# Altium schematic sheet RP2350_CNC_board.SchDoc: RP2040 CNC
size C; Author: AM; CompanyName: Expatria Technologies; DrawnBy: A.Marles; Engineer: AM; Organization: Expatria Technolgoies; Address1: Schematic; DocumentNumber: 2; SheetNumber: 2; SheetTotal: 14
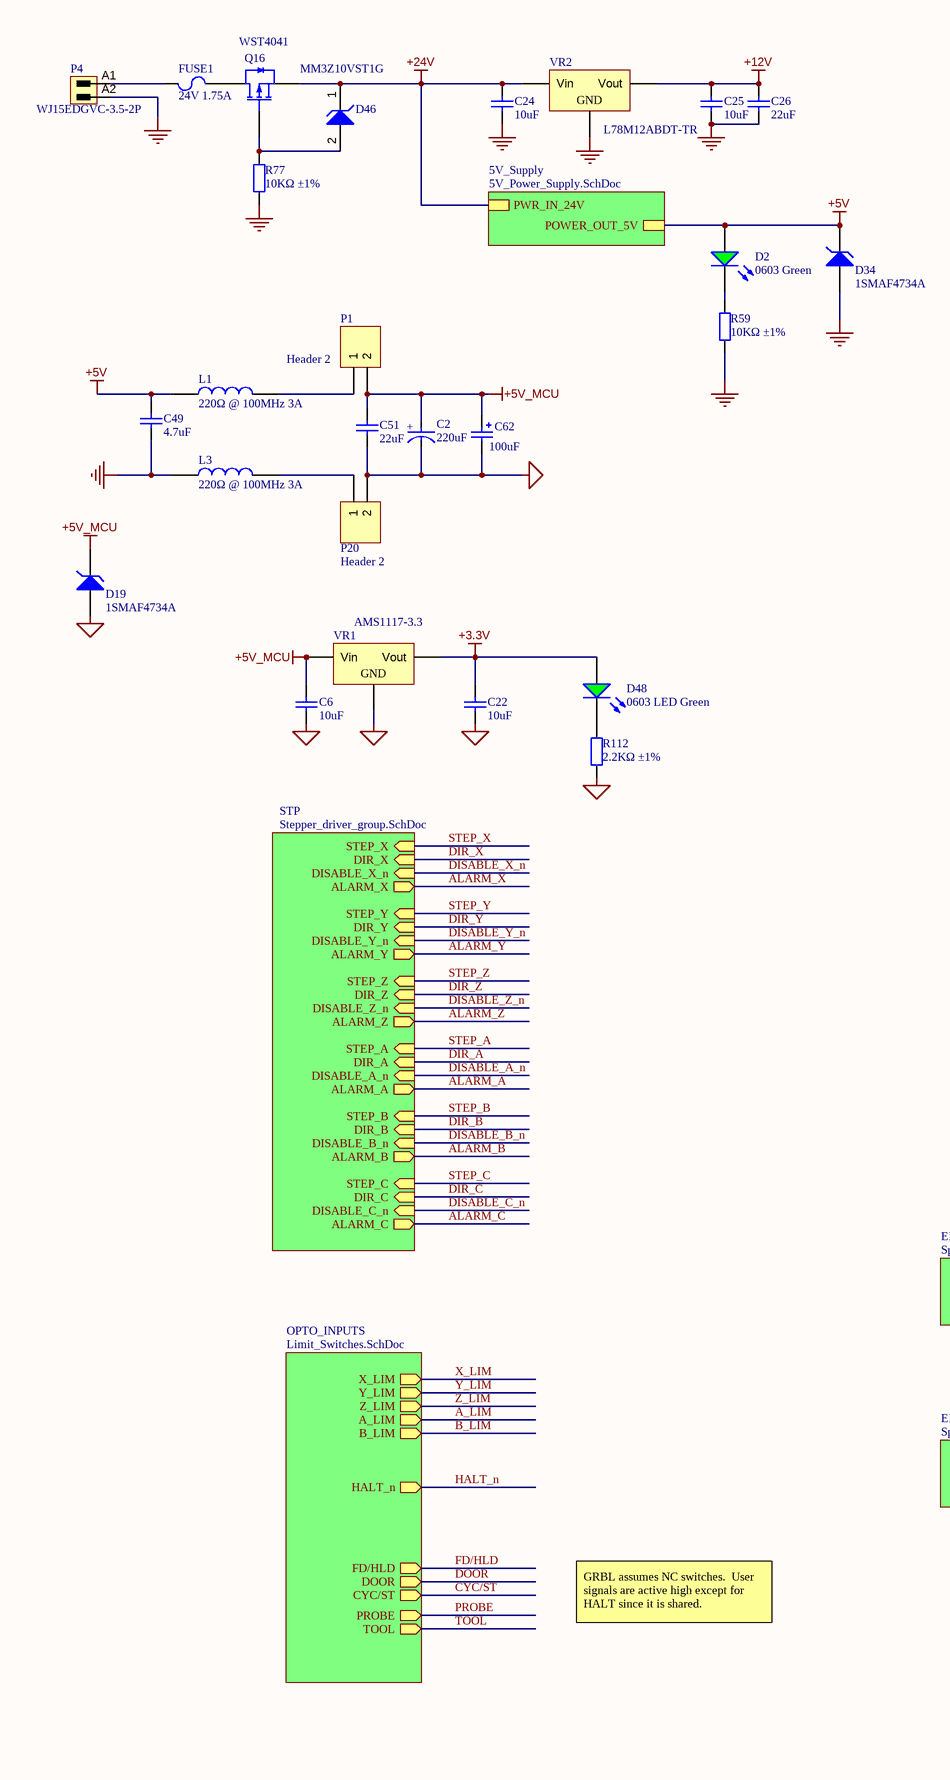
[diagram p0: RP2350_CNC_board.SchDoc, left]
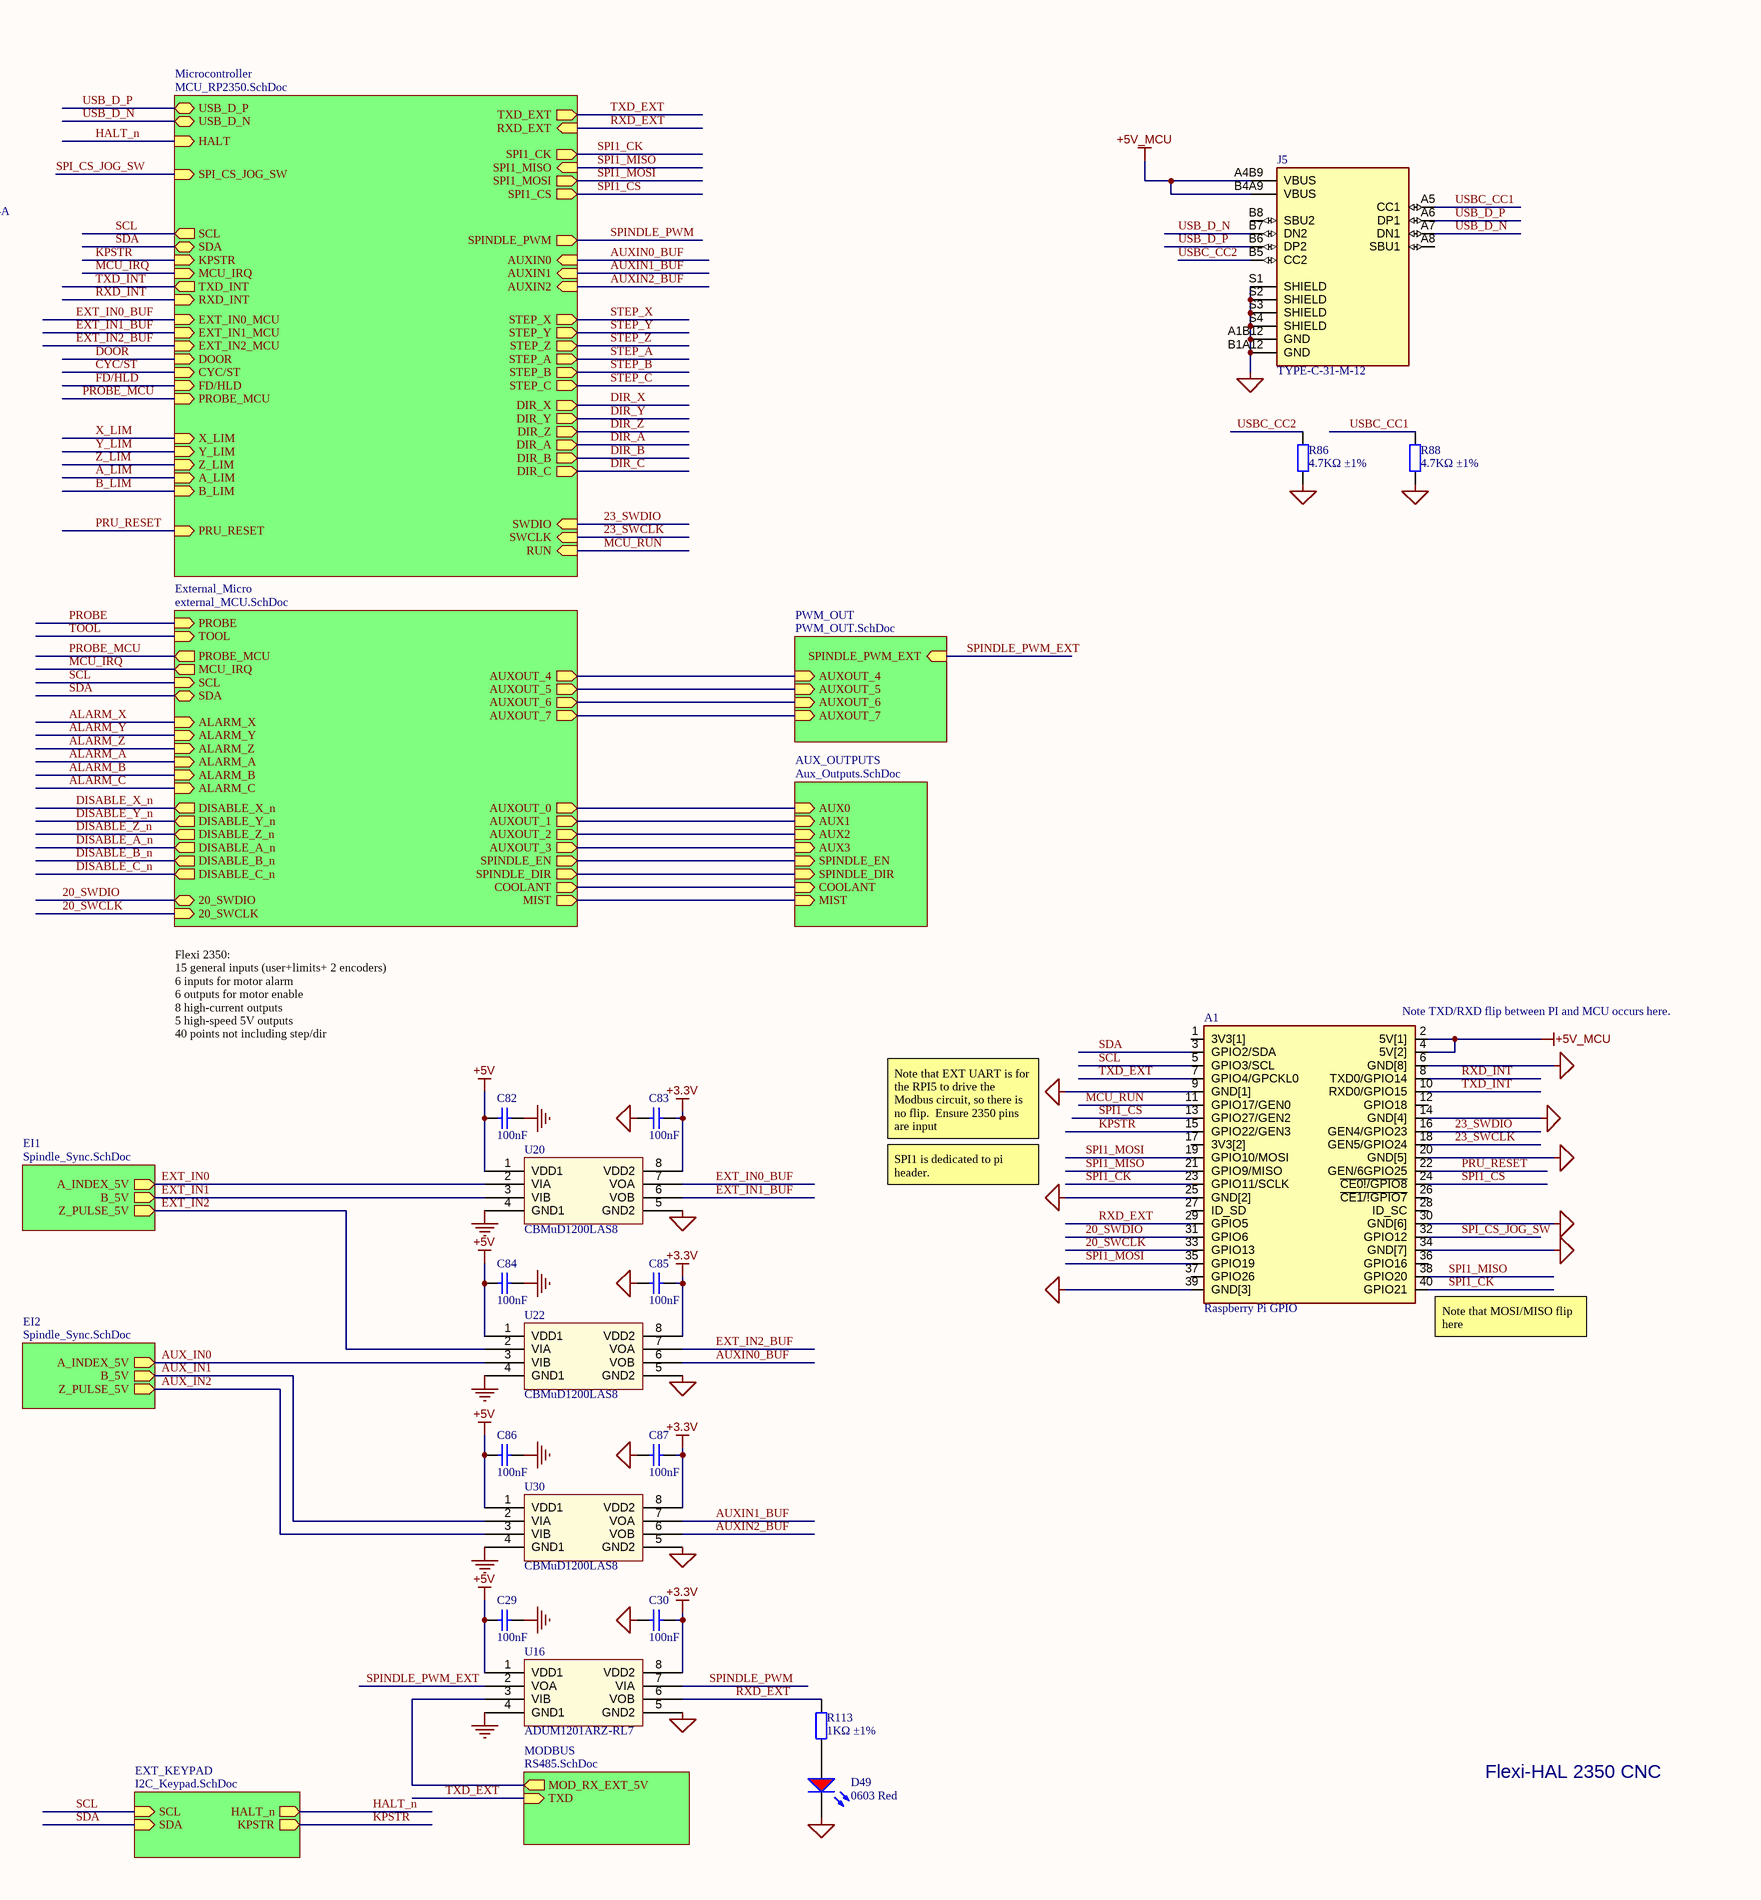
[diagram p1: RP2350_CNC_board.SchDoc, right]

## Parts
A1  Raspberry Pi GPIO  [MODULE_RASPBERRY_PI_4_MODEL_B]
C2  Capacitance: 220uF  [FP-FKG-MFG]  (hidden comment: UUD1H221MNL1GS)
C6  10uF  [1206_C]
C22  10uF  [1206_C]
C24  10uF  [1206_C]
C25  10uF  [1206_C]
C26  22uF  [0805_C]
C29  100nF  [0402_C]
C30  100nF  [0402_C]
C49  4.7uF  [0603_C]
C51  22uF  [0805_C]
C62  100uF  [WCAP-ASLI_D6.3H7.7]
C82  100nF  [0402_C]
C83  100nF  [0402_C]
C84  100nF  [0402_C]
C85  100nF  [0402_C]
C86  100nF  [0402_C]
C87  100nF  [0402_C]
D2  0603 Green  [0603_LED_S1]
D19  1SMAF4734A  [DIOM5226X240N]
D34  1SMAF4734A  [DIOM5226X240N]
D46  MM3Z10VST1G  [ONSC-SOD-323-2-477-02_V]
D48  0603 LED Green  [0603_LED_S1 - GREEN]
D49  0603 Red  [0603_LED_S1]
FUSE1  24V 1.75A  [1206_C]
J5  TYPE-C-31-M-12  [HRO_TYPE-C-31-M-12]
L1  220Ω @ 100MHz 3A  [0805_C]
L3  220Ω @ 100MHz 3A  [0805_C]
P1  Header 2  [HDR1X2]
P4  WJ15EDGVC-3.5-2P  [691321100002]
P20  Header 2  [HDR1X2]
Q16  WST4041  [SOT-23-3L]
R59  10KΩ ±1%  [0402_R]
R77  10KΩ ±1%  [0603_R]
R86  4.7KΩ ±1%  [0402_R]
R88  4.7KΩ ±1%  [0402_R]
R112  2.2KΩ ±1%  [0402_R]
R113  1KΩ ±1%  [0402_R]
U16  ADUM1201ARZ-RL7  [SOIC-8_150mil]
U20  CBMuD1200LAS8  [SOIC-8_150mil]
U22  CBMuD1200LAS8  [SOIC-8_150mil]
U30  CBMuD1200LAS8  [SOIC-8_150mil]
VR1  AMS1117-3.3  [SOT-223]
VR2  L78M12ABDT-TR  [TO-252-2-180]

## Sub-sheets
5V_Supply = 5V_Power_Supply.SchDoc: POWER_OUT_5V, PWR_IN_24V
AUX_OUTPUTS = Aux_Outputs.SchDoc: AUX3 (in), AUX0 (in), AUX1 (in), AUX2 (in), SPINDLE_DIR (in), MIST (in), COOLANT (in), SPINDLE_EN (in)
EI1 = Spindle_Sync.SchDoc: A_INDEX_5V (out), Z_PULSE_5V (out), B_5V (out)
EI2 = Spindle_Sync.SchDoc: A_INDEX_5V (out), Z_PULSE_5V (out), B_5V (out)
EXT_KEYPAD = I2C_Keypad.SchDoc: HALT_n (out), SCL (in), KPSTR (out), SDA (in)
External_Micro = external_MCU.SchDoc: MCU_IRQ (out), SCL (in), SDA (bidir), ALARM_X (in), ALARM_Y (in), ALARM_Z (in), ALARM_A (in), ALARM_B (in), ALARM_C (in), DISABLE_X_n (out), DISABLE_Y_n (out), DISABLE_Z_n (out), DISABLE_A_n (out), DISABLE_B_n (out), DISABLE_C_n (out), SPINDLE_DIR (out), SPINDLE_EN (out), MIST (out), COOLANT (out), AUXOUT_0 (out), AUXOUT_1 (out), AUXOUT_2 (out), AUXOUT_3 (out), AUXOUT_4 (out), AUXOUT_5 (out), AUXOUT_6 (out), AUXOUT_7 (out), PROBE (in), TOOL (in), PROBE_MCU (out), 20_SWDIO (bidir), 20_SWCLK (in)
Microcontroller = MCU_RP2350.SchDoc: USB_D_P (bidir), EXT_IN2_MCU (in), DIR_B (out), EXT_IN1_MCU (in), RXD_INT (in), DIR_Y (out), EXT_IN0_MCU (in), USB_D_N (bidir), DIR_X (out), STEP_B (out), TXD_INT (out), STEP_A (out), SPINDLE_PWM (out), STEP_Z (out), STEP_Y (out), STEP_X (out), SPI_CS_JOG_SW (in), TXD_EXT (out), SDA (bidir), A_LIM (in), SCL (out), DIR_Z (out), KPSTR (in), RXD_EXT (in), HALT (in), DIR_A (out), PRU_RESET (in), X_LIM (in), Z_LIM (in), Y_LIM (in), B_LIM (in), DOOR (in), DIR_C (out), STEP_C (out), SWDIO (in), SWCLK (in), RUN (in), MCU_IRQ (in), CYC/ST (in), AUXIN1 (in), FD/HLD (in), AUXIN0 (in), AUXIN2 (in), SPI1_MISO (in), SPI1_CK (out), SPI1_MOSI (out), SPI1_CS (out), PROBE_MCU (in)
MODBUS = RS485.SchDoc: TXD (in), MOD_RX_EXT_5V (out)
OPTO_INPUTS = Limit_Switches.SchDoc: Y_LIM (out), Z_LIM (out), X_LIM (out), A_LIM (out), B_LIM (out), FD/HLD (out), PROBE (out), CYC/ST (out), HALT_n (out), DOOR (out), TOOL (out)
PWM_OUT = PWM_OUT.SchDoc: AUXOUT_5 (in), AUXOUT_4 (in), SPINDLE_PWM_EXT (in), AUXOUT_7 (in), AUXOUT_6 (in)
STP = Stepper_driver_group.SchDoc: STEP_X (in), DIR_X (in), ALARM_X (out), DISABLE_X_n (in), STEP_Y (in), DIR_Y (in), ALARM_Y (out), DISABLE_Y_n (in), STEP_Z (in), DIR_Z (in), ALARM_Z (out), DISABLE_Z_n (in), STEP_A (in), DIR_A (in), ALARM_A (out), DISABLE_A_n (in), STEP_B (in), DIR_B (in), ALARM_B (out), DISABLE_B_n (in), STEP_C (in), DIR_C (in), ALARM_C (out), DISABLE_C_n (in)

## Nets
+3.3V: C22.2 C30.2 C83.2 C85.2 C87.2 D48.A U16.8(VDD2) U20.8(VDD2) U22.8(VDD2) U30.8(VDD2) VR1.2(Vout)
+5V: C29.1 C49.2 C82.1 C84.1 C86.1 D2.A D34.2(K) L1.1 U16.1(VDD1) U20.1(VDD1) U22.1(VDD1) U30.1(VDD1) ; sheet 5V_Supply/POWER_OUT_5V
+5V_MCU: A1.2(5V[1]) A1.4(5V[2]) C2.2(A) C6.2 C51.2 C62.1(P) D19.2(K) J5.A4B9(VBUS) J5.B4A9(VBUS) P1.2 VR1.3(Vin)
+12V: C25.2 C26.2 VR2.3(Vout)
+24V: C24.2 D46.1(K) Q16.2(S) VR2.1(Vin) ; sheet 5V_Supply/PWR_IN_24V
GND: C24.1 C25.1 C26.1 C29.2 C49.1 C82.2 C84.2 C86.2 D34.1(A) L3.1 P4.A2 R59.1 R77.1 U16.4(GND1) U20.4(GND1) U22.4(GND1) U30.4(GND1) VR2.2(GND)
MCU_GND: A1.6(GND[8]) A1.9(GND[1]) A1.14(GND[4]) A1.20(GND[5]) A1.25(GND[2]) A1.30(GND[6]) A1.34(GND[7]) A1.39(GND[3]) C2.1(C) C6.1 C22.1 C30.1 C51.1 C62.2(N) C83.1 C85.1 C87.1 D19.1(A) D49.K J5.A1B12(GND) J5.B1A12(GND) J5.S1(SHIELD) J5.S2(SHIELD) J5.S3(SHIELD) J5.S4(SHIELD) P20.2 R86.2 R88.2 R112.1 U16.5(GND2) U20.5(GND2) U22.5(GND2) U30.5(GND2) VR1.1(GND)
20_SWCLK: A1.33(GPIO13) ; sheet External_Micro/20_SWCLK
20_SWDIO: A1.31(GPIO6) ; sheet External_Micro/20_SWDIO
23_SWCLK: A1.18(GEN5/GPIO24) ; sheet Microcontroller/SWCLK
23_SWDIO: A1.16(GEN4/GPIO23) ; sheet Microcontroller/SWDIO
A_LIM: sheet Microcontroller/A_LIM, sheet OPTO_INPUTS/A_LIM
ALARM_A: sheet STP/ALARM_A, sheet External_Micro/ALARM_A
ALARM_B: sheet STP/ALARM_B, sheet External_Micro/ALARM_B
ALARM_C: sheet STP/ALARM_C, sheet External_Micro/ALARM_C
ALARM_X: sheet STP/ALARM_X, sheet External_Micro/ALARM_X
ALARM_Y: sheet STP/ALARM_Y, sheet External_Micro/ALARM_Y
ALARM_Z: sheet STP/ALARM_Z, sheet External_Micro/ALARM_Z
AUX_IN0: U22.3(VIB) ; sheet EI2/A_INDEX_5V
AUX_IN1: U30.2(VIA) ; sheet EI2/B_5V
AUX_IN2: U30.3(VIB) ; sheet EI2/Z_PULSE_5V
AUXIN0_BUF: U22.6(VOB) ; sheet Microcontroller/AUXIN0
AUXIN1_BUF: U30.7(VOA) ; sheet Microcontroller/AUXIN1
AUXIN2_BUF: U30.6(VOB) ; sheet Microcontroller/AUXIN2
B_LIM: sheet Microcontroller/B_LIM, sheet OPTO_INPUTS/B_LIM
CYC/ST: sheet Microcontroller/CYC/ST, sheet OPTO_INPUTS/CYC/ST
DIR_A: sheet STP/DIR_A, sheet Microcontroller/DIR_A
DIR_B: sheet STP/DIR_B, sheet Microcontroller/DIR_B
DIR_C: sheet STP/DIR_C, sheet Microcontroller/DIR_C
DIR_X: sheet STP/DIR_X, sheet Microcontroller/DIR_X
DIR_Y: sheet STP/DIR_Y, sheet Microcontroller/DIR_Y
DIR_Z: sheet STP/DIR_Z, sheet Microcontroller/DIR_Z
DISABLE_A_n: sheet STP/DISABLE_A_n, sheet External_Micro/DISABLE_A_n
DISABLE_B_n: sheet STP/DISABLE_B_n, sheet External_Micro/DISABLE_B_n
DISABLE_C_n: sheet STP/DISABLE_C_n, sheet External_Micro/DISABLE_C_n
DISABLE_X_n: sheet STP/DISABLE_X_n, sheet External_Micro/DISABLE_X_n
DISABLE_Y_n: sheet STP/DISABLE_Y_n, sheet External_Micro/DISABLE_Y_n
DISABLE_Z_n: sheet STP/DISABLE_Z_n, sheet External_Micro/DISABLE_Z_n
DOOR: sheet Microcontroller/DOOR, sheet OPTO_INPUTS/DOOR
EXT_IN0: U20.2(VIA) ; sheet EI1/A_INDEX_5V
EXT_IN0_BUF: U20.7(VOA) ; sheet Microcontroller/EXT_IN0_MCU
EXT_IN1: U20.3(VIB) ; sheet EI1/B_5V
EXT_IN1_BUF: U20.6(VOB) ; sheet Microcontroller/EXT_IN1_MCU
EXT_IN2: U22.2(VIA) ; sheet EI1/Z_PULSE_5V
EXT_IN2_BUF: U22.7(VOA) ; sheet Microcontroller/EXT_IN2_MCU
FD/HLD: sheet Microcontroller/FD/HLD, sheet OPTO_INPUTS/FD/HLD
HALT_n: sheet EXT_KEYPAD/HALT_n, sheet Microcontroller/HALT, sheet OPTO_INPUTS/HALT_n
KPSTR: A1.15(GPIO22/GEN3) ; sheet EXT_KEYPAD/KPSTR, sheet Microcontroller/KPSTR
MCU_IRQ: sheet Microcontroller/MCU_IRQ, sheet External_Micro/MCU_IRQ
MCU_RUN: A1.11(GPIO17/GEN0) ; sheet Microcontroller/RUN
PROBE: sheet External_Micro/PROBE, sheet OPTO_INPUTS/PROBE
PROBE_MCU: sheet Microcontroller/PROBE_MCU, sheet External_Micro/PROBE_MCU
PRU_RESET: A1.22(GEN/6GPIO25) ; sheet Microcontroller/PRU_RESET
RXD_EXT: A1.29(GPIO5) R113.1 U16.6(VOB) ; sheet Microcontroller/RXD_EXT
RXD_INT: A1.8(TXD0/GPIO14) ; sheet Microcontroller/RXD_INT
SCL: A1.5(GPIO3/SCL) ; sheet EXT_KEYPAD/SCL, sheet Microcontroller/SCL, sheet External_Micro/SCL
SDA: A1.3(GPIO2/SDA) ; sheet EXT_KEYPAD/SDA, sheet Microcontroller/SDA, sheet External_Micro/SDA
SPI1_CK: A1.23(GPIO11/SCLK) A1.40(GPIO21) ; sheet Microcontroller/SPI1_CK
SPI1_CS: A1.13(GPIO27/GEN2) A1.24(~{CE0!/GPIO8}) ; sheet Microcontroller/SPI1_CS
SPI1_MISO: A1.21(GPIO9/MISO) A1.38(GPIO20) ; sheet Microcontroller/SPI1_MISO
SPI1_MOSI: A1.19(GPIO10/MOSI) A1.35(GPIO19) ; sheet Microcontroller/SPI1_MOSI
SPI_CS_JOG_SW: A1.32(GPIO12) ; sheet Microcontroller/SPI_CS_JOG_SW
SPINDLE_PWM: U16.7(VIA) ; sheet Microcontroller/SPINDLE_PWM
SPINDLE_PWM_EXT: U16.2(VOA) ; sheet PWM_OUT/SPINDLE_PWM_EXT
STEP_A: sheet STP/STEP_A, sheet Microcontroller/STEP_A
STEP_B: sheet STP/STEP_B, sheet Microcontroller/STEP_B
STEP_C: sheet STP/STEP_C, sheet Microcontroller/STEP_C
STEP_X: sheet STP/STEP_X, sheet Microcontroller/STEP_X
STEP_Y: sheet STP/STEP_Y, sheet Microcontroller/STEP_Y
STEP_Z: sheet STP/STEP_Z, sheet Microcontroller/STEP_Z
TOOL: sheet External_Micro/TOOL, sheet OPTO_INPUTS/TOOL
TXD_EXT: A1.7(GPIO4/GPCKL0) ; sheet MODBUS/TXD, sheet Microcontroller/TXD_EXT
TXD_INT: A1.10(RXD0/GPIO15) ; sheet Microcontroller/TXD_INT
USB_D_N: J5.A7(DN1) J5.B7(DN2) ; sheet Microcontroller/USB_D_N
USB_D_P: J5.A6(DP1) J5.B6(DP2) ; sheet Microcontroller/USB_D_P
USBC_CC1: J5.A5(CC1) R88.1
USBC_CC2: J5.B5(CC2) R86.1
X_LIM: sheet Microcontroller/X_LIM, sheet OPTO_INPUTS/X_LIM
Y_LIM: sheet Microcontroller/Y_LIM, sheet OPTO_INPUTS/Y_LIM
Z_LIM: sheet Microcontroller/Z_LIM, sheet OPTO_INPUTS/Z_LIM
NetD2_K: D2.K R59.2
NetD46_2: D46.2(A) Q16.1(G) R77.2
NetD48_K: D48.K R112.2
NetD49_A: D49.A R113.2
NetFUSE1_1: FUSE1.1 P4.A1
NetFUSE1_2: FUSE1.2 Q16.3(D)
NetL1_2: L1.2 P1.1
NetL3_2: L3.2 P20.1
NetU16_3: U16.3(VIB) ; sheet MODBUS/MOD_RX_EXT_5V
(unnamed): sheet External_Micro/SPINDLE_DIR, sheet AUX_OUTPUTS/SPINDLE_DIR
(unnamed): sheet External_Micro/SPINDLE_EN, sheet AUX_OUTPUTS/SPINDLE_EN
(unnamed): sheet External_Micro/MIST, sheet AUX_OUTPUTS/MIST
(unnamed): sheet External_Micro/COOLANT, sheet AUX_OUTPUTS/COOLANT
(unnamed): sheet External_Micro/AUXOUT_0, sheet AUX_OUTPUTS/AUX0
(unnamed): sheet External_Micro/AUXOUT_1, sheet AUX_OUTPUTS/AUX1
(unnamed): sheet External_Micro/AUXOUT_2, sheet AUX_OUTPUTS/AUX2
(unnamed): sheet External_Micro/AUXOUT_3, sheet AUX_OUTPUTS/AUX3
(unnamed): sheet External_Micro/AUXOUT_4, sheet PWM_OUT/AUXOUT_4
(unnamed): sheet External_Micro/AUXOUT_5, sheet PWM_OUT/AUXOUT_5
(unnamed): sheet External_Micro/AUXOUT_6, sheet PWM_OUT/AUXOUT_6
(unnamed): sheet External_Micro/AUXOUT_7, sheet PWM_OUT/AUXOUT_7

Not connected (* = marked no-connect by the designer): A1 1(3V3[1]) 12(GPIO18) 17(3V3[2]) 26(~{CE1/!GPIO7}) 27(ID_SD) 28(ID_SC) 36(GPIO16) 37(GPIO26); J5 A8(SBU1) B8(SBU2)

## Notes on the sheet
- Flexi 2350:
  15 general inputs (user+limits+ 2 encoders)
  6 inputs for motor alarm
  6 outputs for motor enable
  8 high-current outputs
  5 high-speed 5V outputs
  40 points not including step/dir
- (near A1) Note TXD/RXD flip between PI and MCU occurs here.
- Note that EXT UART is for the RPI5 to drive the Modbus circuit, so there is no flip.  Ensure 2350 pins are input
- SPI1 is dedicated to pi header.
- (near A1) Note that MOSI/MISO flip here
- GRBL assumes NC switches.  User signals are active high except for HALT since it is shared.
- Flexi-HAL 2350 CNC
- Expatria Technologies
- SHEET
- PROJECT
- REV
- 1136 Glade Court
- Port Coquitlam, BC V3B 1R5
- EMAIL: INFO@EXPATRIA.CA
- SIZE
- ENGR
- C
- MODIFIED
- DOCUMENT
- /
- Copyright Expatria Technologies 2022. This document describes Open Hardware and is licensed under the CERN-OHL-S v2. No warranty is implied or expressed.
- (in symbol CMP-148-000001-1) +

## Library data of the parts
A1 = ADA3708: Raspberry Pi Zero WH _Zero W with Headers_; MP: DS1023-2*20SF11; MF: CONNFLY Elec; Availability: Unavailable; Package: None; Value: *; Price: None; SuppliersPartNumber: C132132
C2 = CMP-148-000001-1: CAP ALUM 220UF 20% 50V SMD; Manufacturer: Nichicon; Life: 2000Hours; Automotive Grade: Grade 2; Material: Aluminum; Dissipation Factor: 10%; Esr: 0.18Ω; ComponentLink1URL: https://industrial.panasonic.com/cdbs/www-data/pdf/RDE0000/ABA0000C1181.pdf; Tolerance: 20%; Lead Free: Yes; ComponentLink1Description: Datasheet; Digikey Description: CAP ALUM 220UF 20% 50V SMD; Source: Sienci_Labs.SchLib; Voltage Rating: 50V; Package: FKG; Value: 220uF; Design Item ID: UUD1H221MNL1GS; Automotive: Yes; Manufacturer Part Number: UUD1H221MNL1GS; Device Class L2: Capacitors; SuppliersPartNumber: C125976; Device Class L3: Aluminum Electrolytic Capacitors; Device Class L1: Passive Components; Temperature Range High: +105°C; Height: 10.5mm
C6 C22 C24 C25 = 1206 10uF (106) 10% 50V: Chip capacitors; Manufacturer: Samsung Electro-Mechanics; PartNumber: CL31A106KBHNNNE; Tolerance: 10%; Voltage: 50V; ComponentLink1Description: Supplier link; ComponentLink1URL: http://www.szlcsc.com/product/details_14236.html; Package: 1206; Supplier: LC; SuppliersPartNumber: C13585; Capacitance: 10uF
  C6 C22: Manufacturer 1: Samsung Electro-Mechanics
C26 C51 = 0805 22uF (226) 20% 25V: Chip capacitors; Manufacturer: Samsung Electro-Mechanics; PartNumber: CL21A226MAQNNNE; Tolerance: 20%; Voltage: 25V; ComponentLink1Description: Supplier link; ComponentLink1URL: http://www.szlcsc.com/product/details_46786.html; Package: 0805; Supplier: LC; SuppliersPartNumber: C2922481; Capacitance: 22uF
C29 C30 C82-C87 = 0402 100nF (104) 10% 16V: Chip capacitors; Manufacturer: Samsung Electro-Mechanics; PartNumber: CL05B104KO5NNNC; Tolerance: 10%; Voltage: 16V; ComponentLink1Description: Supplier link; ComponentLink1URL: http://www.szlcsc.com/product/details_1877.html; Package: 0402; Supplier: LC; SuppliersPartNumber: C1525; Capacitance: 100nF
C49 = 0603 4.7uF (475) 10% 16V: Chip capacitors; Manufacturer: Samsung Electro-Mechanics; PartNumber: CL10A475KO8NNNC; Tolerance: 10%; Voltage: 16V; ComponentLink1Description: Supplier link; ComponentLink1URL: http://www.szlcsc.com/product/details_20375.html; Package: 0603; Supplier: LC; SuppliersPartNumber: C19666; Capacitance: 4.7uF
C62 = 865080445010: -45℃~+105℃ 2000hrs@105℃ 100uF 7.7mm 35V 6.3mm ±20% SMD,6.3x7.7mm Aluminum Electrolytic Capacitors - SMD ROHS; Manufacturer: Capxon International Elec; SuppliersPartNumber: C59934; Value: 100uF
D2 = 0603 LED Green: LED; ComponentLink1Description: 供应商链接; ComponentLink1URL: http://www.szlcsc.com/product/details_73152.html; Package: 0603; Supplier: LC; SuppliersPartNumber: C72043; Color: Green
D19 D34 = BZT52C27: 27V ±5% 1W 500nA @ 20.5V SMA(DO-214AC) Zener Diodes RoHS; ComponentLink1Description: 供应商链接; ComponentLink1URL: http://www.szlcsc.com/product/details_8541.html; Package: SMAF; Supplier: LC; SuppliersPartNumber: C169539
D46 = MM3Z10VST1G: MM3Z10VST1G Zener Diode, 10V 2% 300 mW SMT 2-Pin SOD-323 | ON Semiconductor MM3Z10VST1G; Packing: Tape and Reel; P Max (W): 0.3; Material: Plastic; Max Power Dissipation: 300mW; Forward Voltage: 900mV; Impedance: 15R; Max Reverse Leakage Current: 500nA; Power Dissipation: 200mW; Test Current: 5mA; Forward Current: 10mA; Reverse Voltage: 6V; PackageVersion: Rev. H, 03/2007; Mounting Technology: Surface Mount; RoHS: Pb-Free; ComponentLink1Description: Manufacturer URL; ComponentLink3URL: http://www.onsemi.com/pub_link/Collateral/477-02.PDF.1; ComponentLink2Description: Datasheet; PackageDescription: 2-Pin SOD, Body 1.7 x 1.25 mm; PackageReference: SOD-323-2-477-02; Manufacturer Part Number: MM3Z10VST1G; ComponentLink2URL: http://www.onsemi.cn/pub_link/Collateral/MM3Z2V4ST1-D.PDF; ComponentLink1URL: http://www.onsemi.com/; DatasheetVersion: Rev. 21; ComponentLink3Description: Package Specification; Manufacturer: On Semiconductor; Supplier: LCSC; Category: Zener Diodes; Case/Package: SOD-323-2; Number of Pins: 2; Min Operating Temperature: -65°C; Max Operating Temperature: 150°C; Packaging: Tape and Reel; Zener Voltage: 10V; Package Quantity: 3000; Max Reverse Current: 500nA; Series: -; Tolerance: 2%; Voltage Tolerance: 2%; Working Voltage: 10V; Voltage Rating (DC): 10V; Power Rating: 200mW; Length: 1.8mm; Width: 1.35mm; Height: 1mm; Radiation Hardening: No; Lead Free: Lead Free; RoHS Compliant: Yes; Reach SVHC Compliant: No; ComponentLink4URL: https://datasheet.ciiva.com/15142/getdatasheetpartid-68935-15142333.pdf?src-supplier=Verical; ComponentLink4Description: https://datasheet.ciiva.com/15142/getdatasheetpartid-68935-15142333.pdf?src-supplier=Verical; ComponentLink5URL: https://datasheet.ciiva.com/8347/mm3z2v4st1-d-8347637.pdf?src-supplier=Avnet; ComponentLink5Description: https://datasheet.ciiva.com/8347/mm3z2v4st1-d-8347637.pdf?src-supplier=Avnet; ComponentLink6URL: https://datasheet.ciiva.com/10637/mm3z2v4st1-d-10637802.pdf?src-supplier=Avnet; ComponentLink6Description: https://datasheet.ciiva.com/10637/mm3z2v4st1-d-10637802.pdf?src-supplier=Avnet; ComponentLink7URL: https://datasheet.ciiva.com/894/mm3z2v4st1-d-894658.pdf?src-supplier=Digikey; ComponentLink7Description: https://datasheet.ciiva.com/894/mm3z2v4st1-d-894658.pdf?src-supplier=Digikey; ComponentLink8URL: https://datasheet.ciiva.com/894/mm3z2v4st1-d-894659.pdf?src-supplier=Digikey; ComponentLink8Description: https://datasheet.ciiva.com/894/mm3z2v4st1-d-894659.pdf?src-supplier=Digikey; ComponentLink9URL: https://datasheet.ciiva.com/894/mm3z2v4st1-d-894660.pdf?src-supplier=Digikey; ComponentLink9Description: https://datasheet.ciiva.com/894/mm3z2v4st1-d-894660.pdf?src-supplier=Digikey; Value: MM3Z10VST1G; SuppliersPartNumber: C235983
D48 = 19-217/GHC-YR1S2/3T: Colorless transparence -40℃~+85℃ 520nm~535nm Emerald 120° 110mW 0603 Light Emitting Diodes (LED) ROHS; Manufacturer: Everlight Elec; Package: 0603; Supplier: LC; SuppliersPartNumber: C72043; Color: Green; Manufacturer Part Number: 19-217/GHC-YR1S2/3T
D49 = 0603 LED Red: LED; ComponentLink1Description: 供应商链接; ComponentLink1URL: http://www.szlcsc.com/product/details_2659.html; Package: 0603; Supplier: LC; SuppliersPartNumber: C2286; Color: Red
FUSE1 = JK-nSMD050-24: 24V 1.75A 0.1s 1206 PTC Resettable Fuses RoHS; Package: 1206; Supplier: LC; SuppliersPartNumber: C22363532
J5 = TYPE-C-31-M-12: USB Connectors 24 Receptacle 1 8.94*7.3mm RoHS; MF: HRO Electronics Co., Ltd.; Value: *; SnapEDA_Link: https://www.snapeda.com/parts/TYPE-C-31-M-12/HRO%20Electronics%20Co.,%20Ltd./view-part/3228496/?ref=snap; Package: Package; MP: TYPE-C-31-M-12; Price: None; Availability: Unavailable; SuppliersPartNumber: C2765186
L1 L3 = 0402 220R@100Mhz 0.1A: 40mΩ ±25% 220Ω@100MHz 0805 Ferrite Beads ROHS; Notepad: *; Package: 0805; Supplier: LC; SuppliersPartNumber: C76818
P1 P20 = Header 2: Header, 2-Pin; Publisher: Altium Limited; LatestRevisionDate: 17-Jul-2002; LatestRevisionNote: Re-released for DXP Platform.; SuppliersPartNumber: C2883961
P4 = 3.5mm Terminal Header 2p: Header,Male Pin,Covered(4 Sided) 2 1 0.138"（3.50mm） 2 P=3.5mm Pluggable System Terminal Block RoHS; UL_94_flammability_rating: V-0; Pitch_mm: 3.5 mm; ComponentLink1Description: Manufacturer URL; ComponentLink1URL: http://www.weidmueller.com/; Revision: V1; SuppliersPartNumber: C192777; Supplier: LCSC
Q16 = AO3401A P道沟 X13A15 SOT-23: 40V 6A 40mΩ@10V,3A 1.4W 2.2V 1 piece P-channel SOT-23 MOSFETs ROHS; ComponentLink1Description: 供应商链接; ComponentLink1URL: http://www.szlcsc.com/product/details_15801.html; Package: SOT-23; Supplier: LC; SuppliersPartNumber: C148357
R59 = 0402 10K (1002) 1%: Chip resistor; Manufacturer: Uniroyal Elec; PartNumber: 0402WGF1002TCE; Power: 1/16W; ComponentLink1Description: Supplier link; ComponentLink1URL: http://www.szlcsc.com/product/details_26487.html; Package: 0402; Supplier: LC; SuppliersPartNumber: C25744; Resistance: 10KΩ; Tolerance: 1%
R77 = 0603 10K (1002) 1%: Chip resistor; Manufacturer: Uniroyal Elec; Manufacturer Part Number: 0603WAF1002T5E; Power: 1/10W; ComponentLink1Description: Supplier link; ComponentLink1URL: http://www.szlcsc.com/product/details_26547.html; Package: 0603; Supplier: LC; SuppliersPartNumber: C25804; Resistance: 10KΩ; Tolerance: 1%
R86 R88 = 0402 4.7K (4701) 1%: Chip resistor; Manufacturer: Uniroyal Elec; PartNumber: 0402WGF4701TCE; Power: 1/16W; ComponentLink1Description: Supplier link; ComponentLink1URL: http://www.szlcsc.com/product/details_26643.html; Package: 0402; Supplier: LC; SuppliersPartNumber: C25900; Resistance: 4.7KΩ; Tolerance: 1%
R112 = 0402 2.2K (2201) 1%: Chip resistor; Manufacturer: Uniroyal Elec; PartNumber: 0402WGF2201TCE; Power: 1/16W; ComponentLink1Description: Supplier link; ComponentLink1URL: http://www.szlcsc.com/product/details_26622.html; Package: 0402; Supplier: LC; SuppliersPartNumber: C25879; Resistance: 2.2KΩ; Tolerance: 1%
R113 = 0402 1K (1001) 1%: Chip resistor; Manufacturer: Uniroyal Elec; PartNumber: 0402WGF1001TCE; Power: 1/16W; ComponentLink1Description: Supplier link; ComponentLink1URL: http://www.szlcsc.com/product/details_12256.html; Package: 0402; Supplier: LC; SuppliersPartNumber: C11702; Resistance: 1KΩ; Tolerance: 1%
U16 = ADUM1201ARZ-RL7_[C9669]: Dual Channel Isolator; Package: SOIC-8_150mil; Supplier: LC; SuppliersPartNumber: C9669; ComponentLink1Description: 供应商链接; ComponentLink1URL: http://www.szlcsc.com/product/details_10199.html
U20 U22 U30 = CBMuD1200LAS8: Dual Channel Isolator; Package: SOIC-8_150mil; Supplier: LC; SuppliersPartNumber: C476470; ComponentLink1Description: 供应商链接; ComponentLink1URL: http://www.szlcsc.com/product/details_10199.html
VR1 = SOT-223 AMS1117-3.3: Vout=3.3V 1A 72dB@(120Hz) (LDO); Manufacturer 1: AMS; ComponentLink1Description: 供应商链接; ComponentLink1URL: http://www.szlcsc.com/product/details_6652.html; Package: SOT-223; Supplier: LC; SuppliersPartNumber: C6186; Manufacturer Part Number 1: AMS1117-3.3
VR2 = TO-252-2 L78M05ABDT-TR: 500mA 55dB@(120Hz) Fixed 12V~12V Positive 1 35V TO-252-2(DPAK) Linear Voltage Regulators (LDO) ROHS; ComponentLink1Description: 供应商链接; ComponentLink1URL: http://www.szlcsc.com/product/details_59107.html; Package: TO-252-2; Supplier: digikey; SuppliersPartNumber: C16424